# EAGLE schematic temp_sensor (EAGLE 6.2)
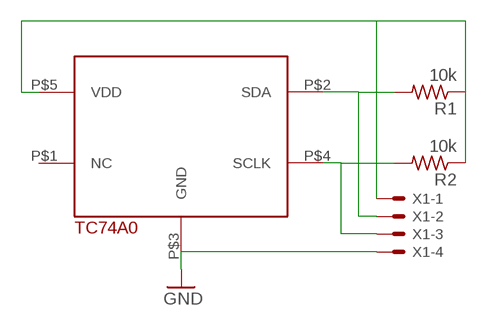
[diagram p0: schematic, sheet 1]

## Parts
R1  10k  R-US_R0805  [R0805]
R2  10k  R-US_R0805  [R0805]
U$1  TC74A0  [TC74A0]
X1  KK-156-4  [KK-156-4]

## Nets
GND: U$1.P$3(GND) X1.4
N$2: R1.2 U$1.P$2(SDA) X1.2
N$3: R2.2 U$1.P$4(SCLK) X1.3
N$4: R1.1 R2.1 U$1.P$5(VDD) X1.1
Unconnected: U$1.P$1(NC)

## Library data of the parts
R1 R2 = adafruit:R-US_: RESISTOR, American symbol
U$1 = Microchip_By_element14_Batch_1:TC74A0
X1 = con-molex:KK-156-4: KK 156 HEADER Source: http://www.molex.com/pdm_docs/sd/026604100_sd.pdf; OC_FARNELL: unknown; OC_NEWARK: unknown